# Altium schematic sheet PX4FMUv2.4.6_11.SchDoc: PX4FMUv2.4.6
size 282 x 200 mm; Date: 2020/2/15 15:44:35; SheetNumber: 12; GateName_1: G$1; SymbolName_1: A4L-LOC; LibraryName: pixhawk2; DeviceSetName: A4L-LOC; Value: Fiducials
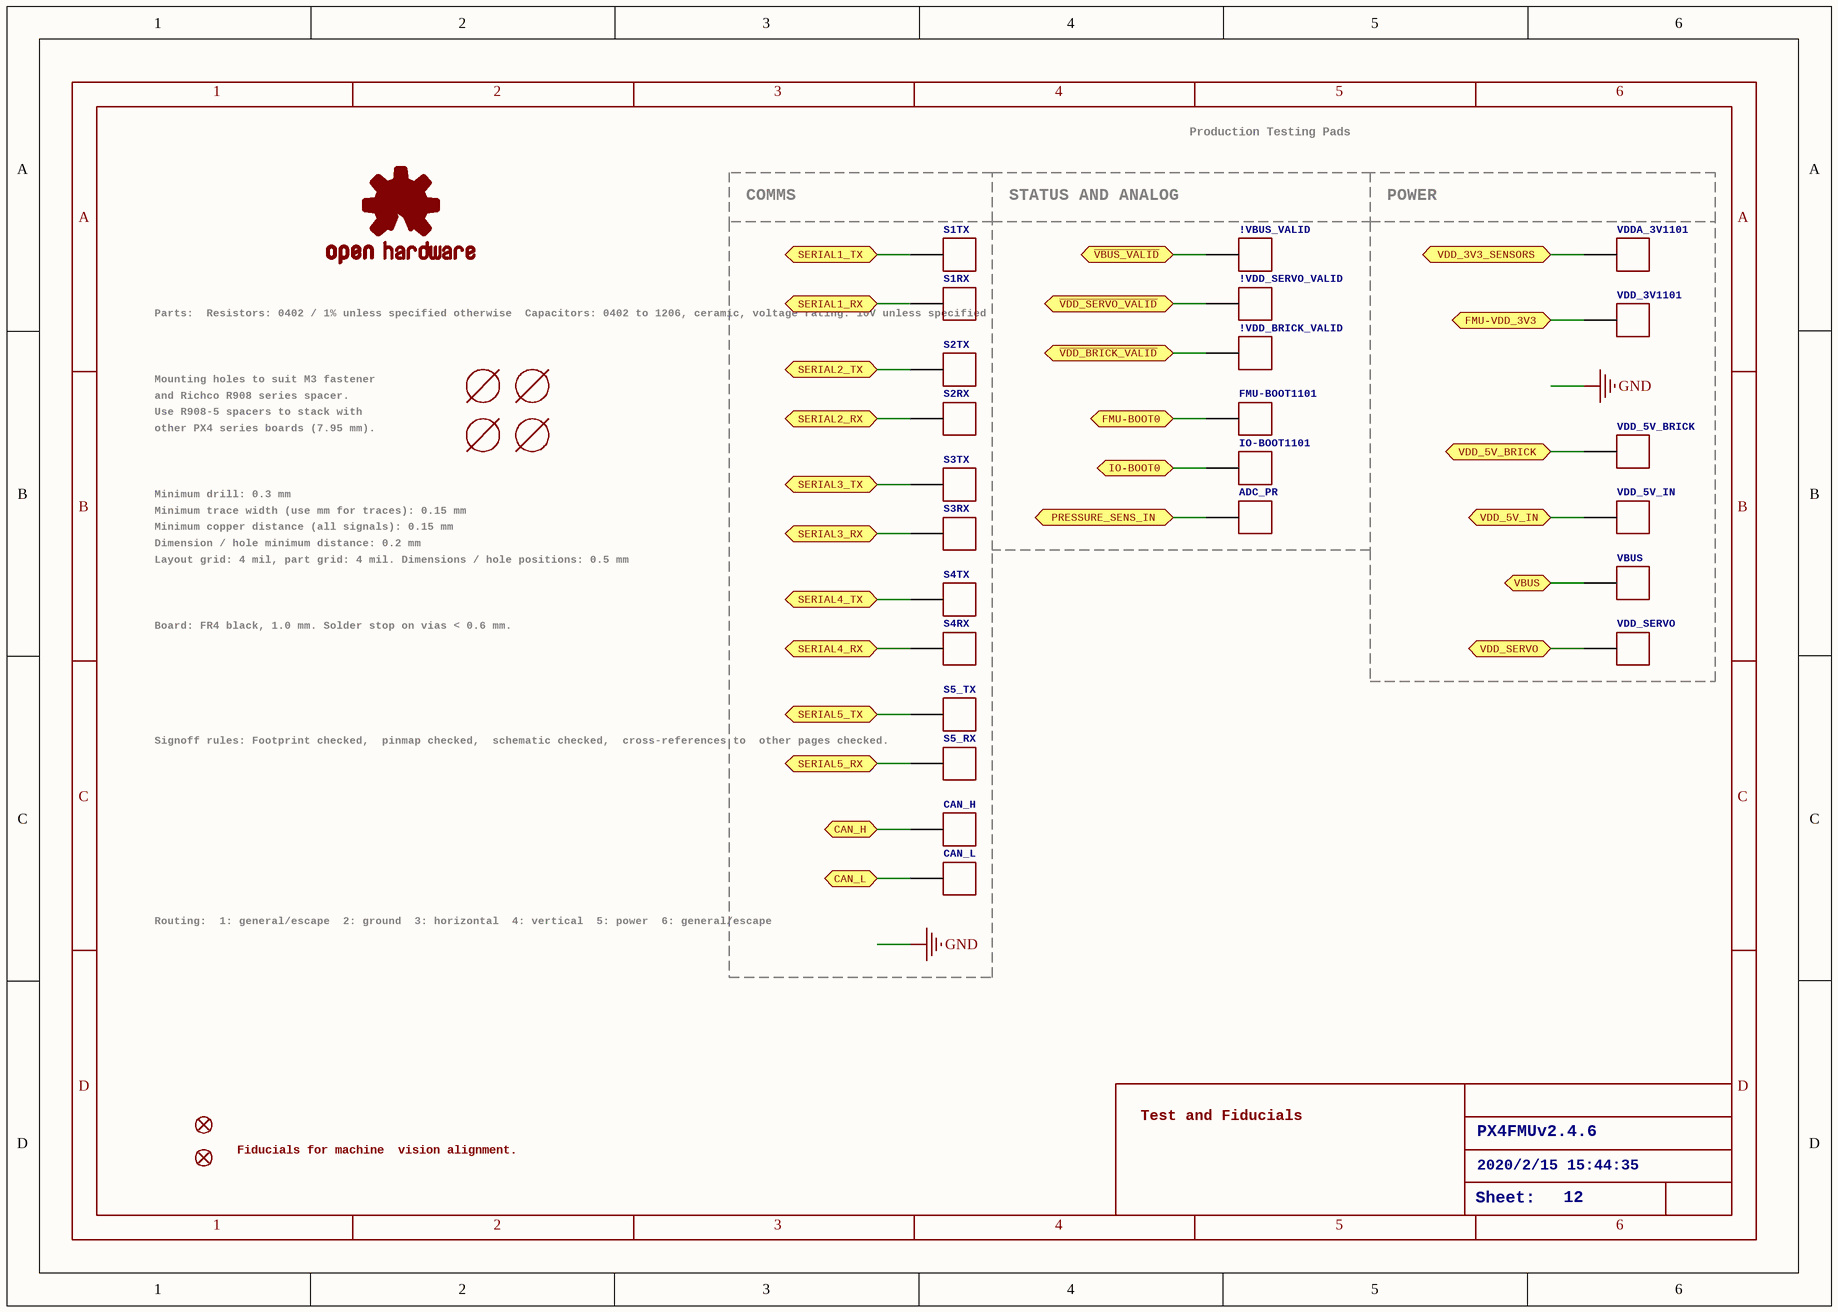
[diagram p0: PX4FMUv2.4.6_11.SchDoc]

## Parts
!VBUS_VALID  PAD.04  [PAD.04X.04]  (value not drawn)
!VDD_BRICK_VALID  PAD.04  [PAD.04X.04]  (value not drawn)
!VDD_SERVO_VALID  PAD.04  [PAD.04X.04]  (value not drawn)
ADC_PR  PAD.04  [PAD.04X.04]  (value not drawn)
CAN_H  PAD.04  [PAD.04X.04]  (value not drawn)
CAN_L  PAD.04  [PAD.04X.04]  (value not drawn)
FMU-BOOT1101  PAD.04  [PAD.04X.04]  (value not drawn)
IO-BOOT1101  PAD.04  [PAD.04X.04]  (value not drawn)
JP1  FIDUCIAL1.5X3  [FIDUCIAL-1.5X3]  (value not drawn)
JP2  FIDUCIAL1.5X3  [FIDUCIAL-1.5X3]  (value not drawn)
M3_MOUNT1101  MOUNT-HOLE3.1MM  [MOUNT-HOLE3.1]  (value not drawn)
M3_MOUNT1102  MOUNT-HOLE3.1MM  [MOUNT-HOLE3.1]  (value not drawn)
M3_MOUNT1103  MOUNT-HOLE3.1MM  [MOUNT-HOLE3.1]  (value not drawn)
M3_MOUNT1104  MOUNT-HOLE3.1MM  [MOUNT-HOLE3.1]  (value not drawn)
OSHW_LOGO  OSHW-LOGOS  [OSHW-LOGO-S]  (value not drawn)
S1RX  PAD.04  [PAD.04X.04]  (value not drawn)
S1TX  PAD.04  [PAD.04X.04]  (value not drawn)
S2RX  PAD.04  [PAD.04X.04]  (value not drawn)
S2TX  PAD.04  [PAD.04X.04]  (value not drawn)
S3RX  PAD.04  [PAD.04X.04]  (value not drawn)
S3TX  PAD.04  [PAD.04X.04]  (value not drawn)
S4RX  PAD.04  [PAD.04X.04]  (value not drawn)
S4TX  PAD.04  [PAD.04X.04]  (value not drawn)
S5_RX  PAD.04  [PAD.04X.04]  (value not drawn)
S5_TX  PAD.04  [PAD.04X.04]  (value not drawn)
VBUS  PAD.04  [PAD.04X.04]  (value not drawn)
VDD_3V1101  PAD.04  [PAD.04X.04]  (value not drawn)
VDD_5V_BRICK  PAD.04  [PAD.04X.04]  (value not drawn)
VDD_5V_IN  PAD.04  [PAD.04X.04]  (value not drawn)
VDD_SERVO  PAD.04  [PAD.04X.04]  (value not drawn)
VDDA_3V1101  PAD.04  [PAD.04X.04]  (value not drawn)

## Ports
CAN_H, CAN_L, FMU-BOOT0, FMU-VDD_3V3, IO-BOOT0, PRESSURE_SENS_IN, SERIAL1_RX, SERIAL1_TX, SERIAL2_RX, SERIAL2_TX, SERIAL3_RX, SERIAL3_TX, SERIAL4_RX, SERIAL4_TX, SERIAL5_RX, SERIAL5_TX, VBUS, VDD_3V3_SENSORS, VDD_5V_BRICK, VDD_5V_IN, VDD_SERVO, ~{VBUS_VALID}, ~{VDD_BRICK_VALID}, ~{VDD_SERVO_VALID}

## Nets
CAN_H: CAN_H.P$1 ; port CAN_H
CAN_L: CAN_L.P$1 ; port CAN_L
FMU-BOOT0: FMU-BOOT1101.P$1 ; port FMU-BOOT0
FMU-VDD_3V3: VDD_3V1101.P$1 ; port FMU-VDD_3V3
IO-BOOT0: IO-BOOT1101.P$1 ; port IO-BOOT0
PRESSURE_SENS_IN: ADC_PR.P$1 ; port PRESSURE_SENS_IN
SERIAL1_RX: S1RX.P$1 ; port SERIAL1_RX
SERIAL1_TX: S1TX.P$1 ; port SERIAL1_TX
SERIAL2_RX: S2RX.P$1 ; port SERIAL2_RX
SERIAL2_TX: S2TX.P$1 ; port SERIAL2_TX
SERIAL3_RX: S3RX.P$1 ; port SERIAL3_RX
SERIAL3_TX: S3TX.P$1 ; port SERIAL3_TX
SERIAL4_RX: S4RX.P$1 ; port SERIAL4_RX
SERIAL4_TX: S4TX.P$1 ; port SERIAL4_TX
SERIAL5_RX: S5_RX.P$1 ; port SERIAL5_RX
SERIAL5_TX: S5_TX.P$1 ; port SERIAL5_TX
~{VBUS_VALID}: !VBUS_VALID.P$1 ; port ~{VBUS_VALID}
~{VDD_BRICK_VALID}: !VDD_BRICK_VALID.P$1 ; port ~{VDD_BRICK_VALID}
~{VDD_SERVO_VALID}: !VDD_SERVO_VALID.P$1 ; port ~{VDD_SERVO_VALID}
VBUS: VBUS.P$1 ; port VBUS
VDD_3V3_SENSORS: VDDA_3V1101.P$1 ; port VDD_3V3_SENSORS
VDD_5V_BRICK: VDD_5V_BRICK.P$1 ; port VDD_5V_BRICK
VDD_5V_IN: VDD_5V_IN.P$1 ; port VDD_5V_IN
VDD_SERVO: VDD_SERVO.P$1 ; port VDD_SERVO

## Notes on the sheet
- Production Testing Pads
- COMMS
- STATUS AND ANALOG
- POWER
- Parts:
  Resistors: 0402 / 1% unless specified otherwise
  Capacitors: 0402 to 1206, ceramic, voltage rating: 10V unless specified
- Mounting holes to suit M3 fastener
- and Richco R908 series spacer.
- Use R908-5 spacers to stack with
- other PX4 series boards (7.95 mm).
- Minimum drill: 0.3 mm
- Minimum trace width (use mm for traces): 0.15 mm
- Minimum copper distance (all signals): 0.15 mm
- Dimension / hole minimum distance: 0.2 mm
- Layout grid: 4 mil, part grid: 4 mil. Dimensions / hole positions: 0.5 mm
- Board: FR4 black, 1.0 mm. Solder stop on vias < 0.6 mm.
- Signoff rules: Footprint checked,
  pinmap checked,
  schematic checked,
  cross-references to
  other pages checked.
- Routing:
  1: general/escape
  2: ground
  3: horizontal
  4: vertical
  5: power
  6: general/escape
- Fiducials for machine
  vision alignment.
- Test and Fiducials
- PX4FMUv2.4.6
- 2020/2/15 15:44:35
- Sheet:
- 12
- 1
- 2
- 3
- 4
- 5
- 6
- A
- B
- C
- D

## Library data of the parts
!VBUS_VALID !VDD_BRICK_VALID !VDD_SERVO_VALID ADC_PR CAN_H CAN_L FMU-BOOT1101 IO-BOOT1101 S1RX S1TX S2RX S2TX S3RX S3TX S4RX S4TX S5_RX S5_TX VBUS VDD_3V1101 VDD_5V_BRICK VDD_5V_IN VDD_SERVO VDDA_3V1101 = PAD.04: Test padThis footprint includes three classes: The actual test pads, a pogo-pin footprint to mount the pogo-pin as through-hole part and a hole footprint which allows the head of the pogo-pin to pass through (do NOT use the hole to mount the pogo-pin). In a typical test setup, the stack would consist of three PCBs: The actual PCB under testing with a test pad on the bottom, then a second PCB with the hole for the pogo-pin head where the PCB under testing is pressed on and a third PCB at 30 mm / 1.2" distance with the pogo-pin footprints. The pogo-pins are soldered to the last PCB. To create the stack, copy the board under testing and exchange the footprints - this way the correct positioning is ensured.; GateName_1: G$1; DeviceName: .04; BOM: EXCLUDE; SymbolName_1: PAD; LibraryName: pixhawk2; DeviceSetName: PAD; PARTNO: *
JP1 JP2 = FIDUCIAL1.5X3: Fiducial Alignment PointsVarious fiducial points for machine vision alignment.; GateName_1: G$1; DeviceName: 1.5X3; BOM: EXCLUDE; SymbolName_1: FIDUCIAL; LibraryName: pixhawk2; DeviceSetName: FIDUCIAL; PARTNO: *
M3_MOUNT1101-M3_MOUNT1104 = MOUNT-HOLE3.1MM: GateName_1: G$1; DeviceName: 3.1MM; BOM: EXCLUDE; SymbolName_1: MOUNT-HOLE; LibraryName: pixhawk2; DeviceSetName: MOUNT-HOLE; PARTNO: *
OSHW_LOGO = OSHW-LOGOS: Open Source Hardware Logo This logo indicates the piece of hardware it is found on incorporates a OSHW license and/or adheres to the definition of open source hardware found here: http://freedomdefined.org/OSHW; GateName_1: G$1; DeviceName: S; BOM: EXCLUDE; SymbolName_1: OSHW-LOGO; LibraryName: pixhawk2; DeviceSetName: OSHW-LOGO; PARTNO: *